# EAGLE design schematic0.1v (EAGLE 7.7.0)
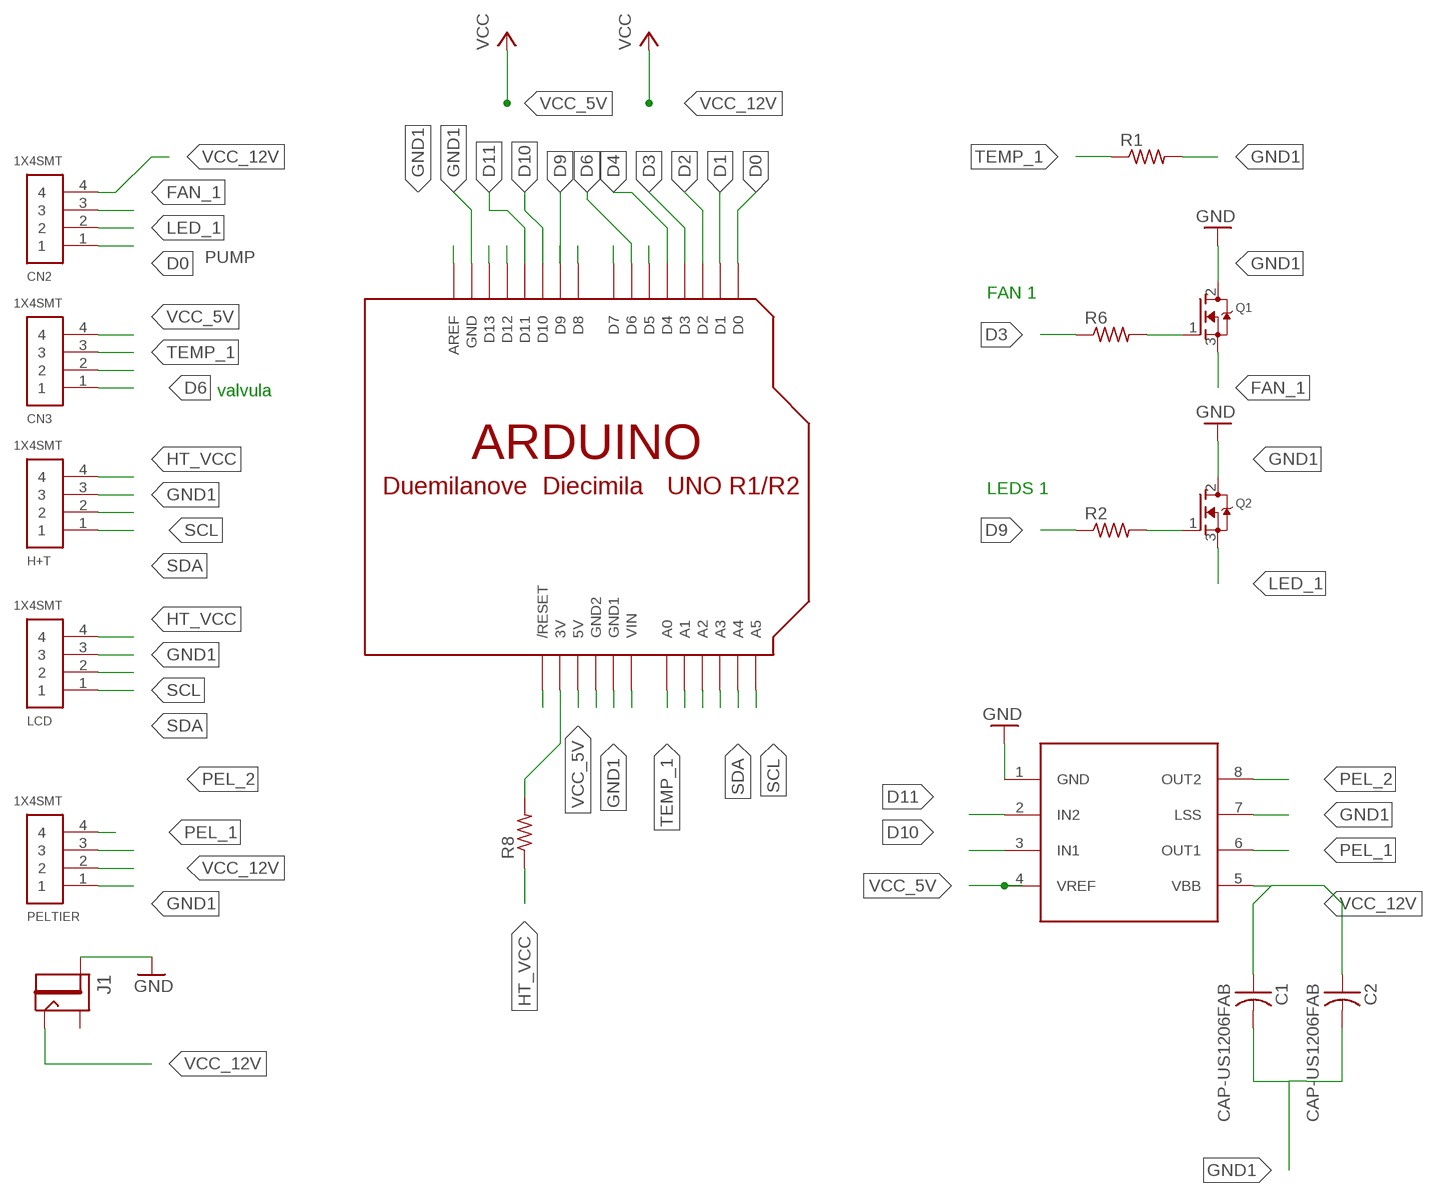
[diagram p0: schematic, sheet 1]

## Parts
C1  CAP-US1206FAB  [C1206FAB]
C2  CAP-US1206FAB  [C1206FAB]
CN2  1X4SMT  [1X4-SMT]
CN3  1X4SMT  [1X4-SMT]
H+T  1X4SMT  [1X4-SMT]
J1  JACK2.1MM  [JACK_2.1MM]
LCD  1X4SMT  [1X4-SMT]
PELTIER  1X4SMT  [1X4-SMT]
Q1  MOSFET-NGDS_TO220V  [TO220V]
Q2  MOSFET-NGDS_TO220V  [TO220V]
R1  RES-US1206  [R1206]
R2  RES-US1206  [R1206]
R6  RES-US1206  [R1206]
R8  RES-US1206  [R1206]
U$1  ARDUINOUNO  [ARDUINO]
U$2  A4953-H-BRIDGE-MOTOR-DRIVER  [SOIC8]

## Nets
D0: CN2.1 U$1.D0
D1: U$1.D1
D2: U$1.D2
D3: R6.1 U$1.D3
D4: U$1.D4
D6: CN3.2 U$1.D6
D9: R2.1 U$1.D9
D10: U$1.D10 U$2.3(IN1)
D11: U$1.D11 U$2.2(IN2)
FAN_1: CN2.3 Q1.3(S)
GND1: C1.2 C2.2 H+T.3 J1.PIN LCD.3 PELTIER.1 Q1.2(D) Q2.2(D) R1.2 U$1.GND U$1.GND2 U$2.1(GND) U$2.7(LSS) ; supply symbol labelled GND
HT_VCC: H+T.4 LCD.4 R8.1
LED_1: CN2.2 Q2.3(S)
N$1: Q1.1(G) R6.2
N$2: Q2.1(G) R2.2
N$4: U$1.D8
N$6: U$1.D5
N$7: R8.2 U$1.3V
N$8: U$1.D7
N$13: U$1.D12
N$14: U$1.D13
N$16: U$1.AREF
N$17: CN3.1
N$19: U$1.A3
N$20: U$1.A2
N$21: U$1.A1
N$23: U$1.VIN
N$24: U$1.GND1
N$28: U$1.RESET(/RESET)
PEL_1: PELTIER.3 U$2.6(OUT1)
PEL_2: PELTIER.4 U$2.8(OUT2)
SCL: H+T.2 LCD.2 U$1.A5
SDA: H+T.1 LCD.1 U$1.A4
TEMP_1: CN3.3 R1.1 U$1.A0
VCC_5V: CN3.4 U$1.5V U$2.4(VREF) ; supply symbol labelled VCC
VCC_12V: C1.1 C2.1 CN2.4 J1.CONTACT PELTIER.2 U$2.5(VBB) ; supply symbol labelled VCC
Unconnected: J1.SHUNT

## Notes on the sheet
- PUMP
- FAN 1
- valvula
- LEDS 1

## Library data of the parts
C1 C2 = fab:CAP-US
CN2 CN3 H+T LCD PELTIER = adafruit:1X4: 4-pin connector
J1 = fab:JACK
Q1 Q2 = adafruit:MOSFET-N: N-Channel Mosfet 2N7002E - 60V 260mA SOT23 [Digikey: 2N7002ET1GOSTR-ND] - REEL BSH103 - 30V 850mA SOT23 [Digikey: 568-5013-1-ND]
R1 R2 R6 R8 = fab:RES-US: Resistor (US Symbol) Variants with postfix FAB are widened to allow the routing of internal traces
U$1 = adafruit:ARDUINO: Arduino Diecimila/Duemilanove Make a shield with ease, this package has all the named pins as well as the two mounting drill holes and an outline of the USB and DC power connector. The outline is on the DIMENSION layer, so if your board house uses it they will cut the outline to match. http://www.ladyada.net/library/pcb/eaglelibrary.html
U$2 = fab:A4953-H-BRIDGE-MOTOR-DRIVER

## Board
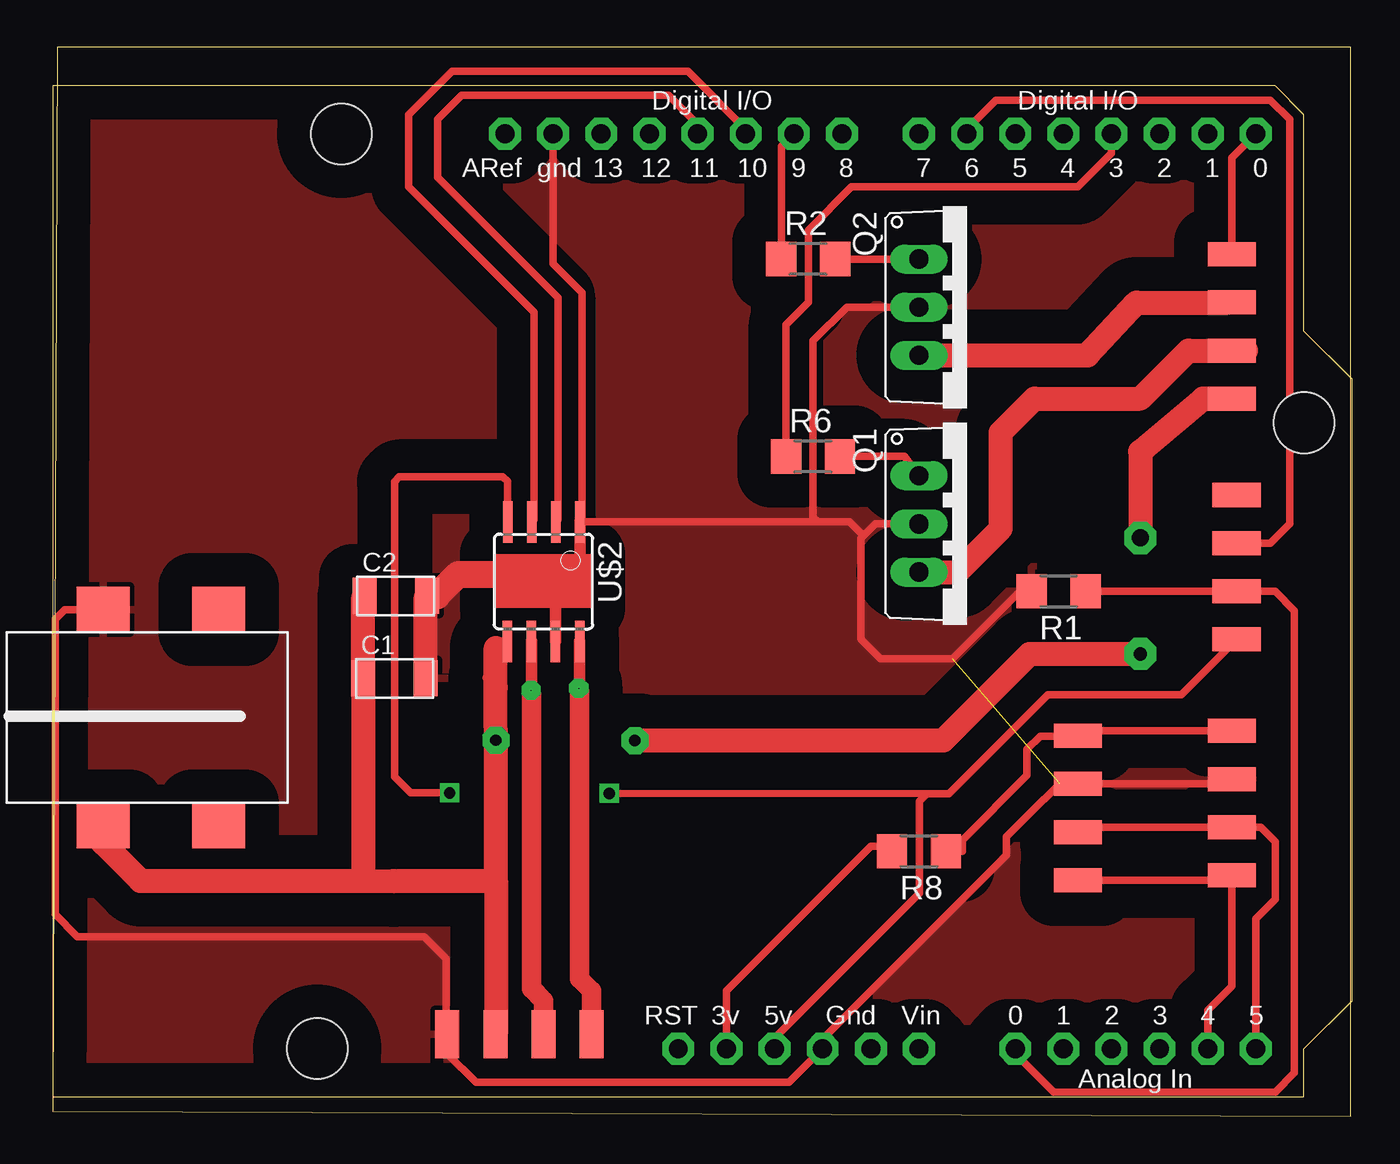
[diagram p1: board, top side]
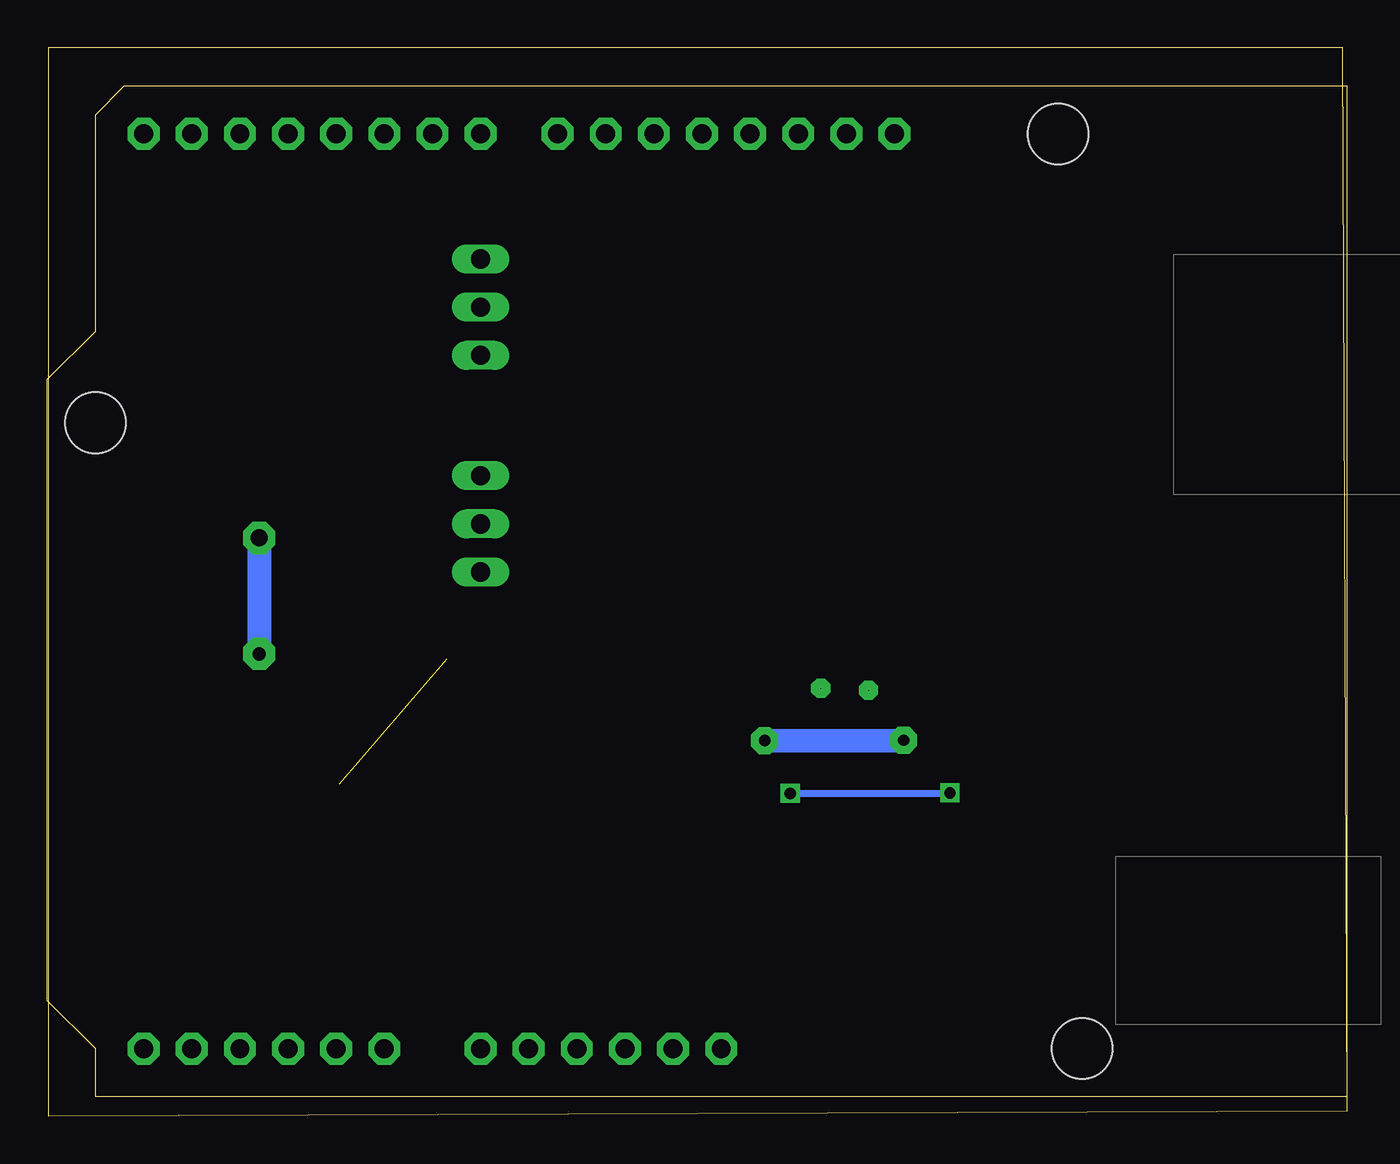
[diagram p2: board, bottom side, seen from below]

Size 68.5 x 56.38 mm. Coordinates in mm from the lower left corner, seen from the top.
Outline: 0,0.25 68.5,0 68.5,56.38 0.25,56.38 0,0.25
Copper layers (1*16): Top 0.035mm / dielectric 1.5mm / Bottom 0.035mm
Design rules "default": minimum track width 10mil, minimum drill 24mil, track to track 8mil, track to pad 8mil, pad to pad 8mil, via to via 8mil, smd to smd 8mil, copper to edge 40mil, drill to drill 8mil, minimum pad ring 10mil, minimum via ring 8mil, stop-mask expansion 4mil, vias tented up to drill 0mil, thermal gap 10mil

### Footprints (pad centres in the part's own frame; a part is rotated, then mirrored left to right if it is on the bottom)
C1206FAB = smd 1.27 x 1.905: 1 -1.651,0; 2 1.651,0
1X4-SMT = smd 1.27 x 2.54: 1 -3.81,0; 2 -1.27,0; 3 1.27,0; 4 3.81,0
JACK_2.1MM = smd 2.388 x 2.794: CONTACT 5.766,-2.413; PIN -5.639,-2.413; PIN1 -5.639,3.683; SHUNT 5.766,3.683
TO220V = drill 1.016 long: 1 -2.54,-2.54; 2 0,-2.54; 3 2.54,-2.54
R1206 = smd 1.6 x 1.803: 1 -1.422,0; 2 1.422,0
ARDUINO = drill 1 pad 1.676 octagon: 3V 35.56,2.54; 5V 38.1,2.54; A0 50.8,2.54; A1 53.34,2.54; A2 55.88,2.54; A3 58.42,2.54; A4 60.96,2.54; A5 63.5,2.54; AREF 23.876,50.8; D0 63.5,50.8; D1 60.96,50.8; D2 58.42,50.8; D3 55.88,50.8; D4 53.34,50.8; D5 50.8,50.8; D6 48.26,50.8; D7 45.72,50.8; D8 41.656,50.8; D9 39.116,50.8; D10 36.576,50.8; D11 34.036,50.8; D12 31.496,50.8; D13 28.956,50.8; GND 26.416,50.8; GND1 43.18,2.54; GND2 40.64,2.54; RESET 33.02,2.54; VIN 45.72,2.54 | hole 3.2: 15.24,50.8; 66.04,35.56; 13.97,2.54
SOIC8 = smd 0.5 x 2.2: 1 -1.905,-3.154; 2 -0.645,-3.154; 3 0.625,-3.154; 4 1.895,-3.154; 5 1.905,3.154; 6 0.635,3.154; 7 -0.635,3.154; 8 -1.905,3.154

### Placement (x,y rotation side)
C1  18.04,23.09 0 top
C2  18.11,27.45 0 top
CN2  62.23,41.66 270 top
CN3  62.48,28.96 270 top
H+T  62.23,16.51 90 top
J1  5.08,21.08 270 top
LCD  54.1,16.26 90 top
PELTIER  24.64,4.32 0 top
Q1  48.26,31.24 270 top
Q2  48.26,42.67 270 top
R1  53.09,27.69 180 top
R2  39.88,45.21 0 top
R6  40.13,34.8 0 top
R8  45.72,13.97 180 top
U$1  0,1.02 0 top
U$2  25.91,28.19 180 top

### Tracks (layer width: path | path; a pad name or v marks a point on that pad's centre or on a via)
D0
  Top 0.406: CN2.1 62.23,50.55 U$1.D0
D3
  Top 0.406: U$1.D3 55.88,50.8 54.1,49.02 42.16,49.02 39.88,46.74 39.88,42.93 38.71,41.76 R6.1
D6
  Top 0.406: U$1.D6 48.26,52.07 49.78,53.59 64.26,53.59 65.28,52.58 65.28,31.24 64.26,30.23 CN3.2
D9
  Top 0.406: U$1.D9 38.46,51.16 R2.1
D10
  Top 0.406: U$1.D10 36.58,52.07 33.53,55.12 21.08,55.12 18.8,52.83 18.8,49.02 25.4,42.42 25.4,31.46 U$2.3
D11
  Top 0.406: U$1.D11 34.04,52.32 32.51,53.85 21.59,53.85 20.32,52.58 20.32,49.53 26.67,43.18 26.67,31.46 U$2.2
FAN_1
  Top 1.27: Q1.3 47.75,28.7 50.04,30.99 50.04,36.07 51.82,37.85 57.4,37.85 59.94,40.39 CN2.3 62.99,40.39
GND1  (1 unrouted)
  Top 0.406: H+T.3 61.98,17.53 LCD.3 53.15,17.53 52.34,16.71 52.3,16.71 50.33,14.74 50.33,13.75 47.32,10.75 40.64,4.06 U$1.GND2 38.86,1.78 22.35,1.78 20.83,3.3 PELTIER.1 20.78,4.37 20.78,8.3 19.6,9.47 1.31,9.47 0.13,10.65 0.13,26.21 0.64,26.72 J1.PIN | R1.2 51.05,27.69 47.5,24.13 43.69,24.13 42.67,25.15 42.67,30.48 42.8,30.61 | 42.8,30.61 43.43,31.24 Q1.2 | U$2.1 40.39,31.35 | 40.39,31.35 42.06,31.35 42.8,30.61 | U$1.GND 26.42,44.96 27.94,43.43 27.94,31.48 U$2.1 | Q2.2 41.91,42.67 40.13,40.89 40.13,31.6 40.39,31.35 | U$2.1 27.84,31.39 | 27.84,29.27 26.55,29.23 26.55,29 26.54,29 26.54,28.53 26.5,28.57 | 19.69,27.38 C2.2 20.27,27.45
  Top 0.61: 27.84,31.39 27.84,29.27 | 26.54,28.53 U$2.7
  Top 1.27: C1.2 19.69,27.38
  Top 1.422: 20.27,27.45 21.4,28.57 26.5,28.57
  pour Top (isolate 1.778): 0.25,56.39 68.58,56.39 68.58,-0.25 0.25,-0.25
HT_VCC
  Top 0.406: H+T.4 54.36,20.32 LCD.4 54.07,20.04 52.12,20.04 51.43,19.34 51.43,17.98 48.01,14.56 48.01,13.97 R8.1
LED_1
  Top 1.27: Q2.3 54.61,40.13 57.19,42.92 62.02,42.92 CN2.2
N$1
  Top 0.406: Q1.1 44.96,34.8 R6.2
N$2
  Top 0.406: R2.2 Q2.1
N$3  (via drill 0.7 pad 1.68)
  other vias: 57.4,30.48
N$5  (via drill 0.03 pad 1.02)
  other vias: 27.77,22.57
N$7
  Top 0.406: U$1.3V 35.56,6.6 43.18,14.22 44.04,14.22 R8.2
N$9  (via drill 0.03 pad 1.02)
  other vias: 25.25,22.46
N$10
  Top 0.406: 62.4,24.96 62.4,24.92 62.33,24.85
PEL_1
  Top 0.406: 25.91,6.1 25.78,6.22 | 25.27,6.73 25.4,6.6
  Top 0.61: U$2.6 25.27,22.24
  Top 1.016: PELTIER.3 25.91,6.1 | 25.78,6.22 25.4,6.6 | 25.27,22.24 25.27,6.73
PEL_2
  Top 0.61: U$2.8 27.81,22.4
  Top 1.016: 27.81,22.4 27.82,22.4 27.81,7.24 28.45,6.6 PELTIER.4
SCL
  Top 0.406: U$1.A5 63.5,10.41 64.52,11.43 64.52,14.48 63.75,15.24 62.74,15.24 H+T.2 54.36,15.24 LCD.2
SDA
  Top 0.406: LCD.1 61.98,12.45 H+T.1 62.23,6.86 60.96,5.59 U$1.A4
TEMP_1
  Top 0.406: U$1.A0 50.8,3.3 52.83,1.27 64.52,1.27 65.53,2.29 65.53,26.67 64.52,27.69 CN3.3 R1.1
VCC_5V  (via drill 0.6)
  Top 0.406: U$2.4 24,33.48 23.75,33.73 18.29,33.73 18.05,33.45 18.05,17.91 18.9,17.06 20.99,17.06 v20.95,17.05 | v29.38,17.03 46.15,17 | 46.15,17 47.3,17 52.53,22.23 59.57,22.23 CN3.4 | U$1.5V 38.1,4.11 45.75,11.77 45.75,16.61 46.15,17
  Bottom 0.406: v20.95,17.05 21.09,17.02 v29.38,17.03
VCC_12V  (via drill 0.6 pad 1.42, 0.7 pad 1.68, 0.9 pad 1.68)
  Top 0.406: U$2.5 23.52,25.04 23.38,24.7 | 22.88,23.12 23.38,22.62 | 16.39,27.38 C2.1 | 16.39,12.7 16.1,12.41
  Top 1.27: CN2.4 60.73,37.85 57.4,35.05 v57.4,30.51 | v30.73,19.81 46.99,19.81 51.56,24.38 v57.4,24.38 | J1.CONTACT 2.67,14.39 4.65,12.41 16.1,12.41 17.99,12.4 18.27,12.41 23.41,12.41 | 23.41,12.41 23.41,19.89 v23.4,19.83 23.38,21.13 23.38,22.62 23.38,24.7 | 23.41,12.41 23.41,4.36 PELTIER.2 | 16.39,27.38 C1.1 16.39,12.7
  Bottom 1.27: v30.73,19.81 v23.4,19.83 | v57.4,30.51 v57.4,24.38
(copper drawn outside any net)
  shapes: Top area x1